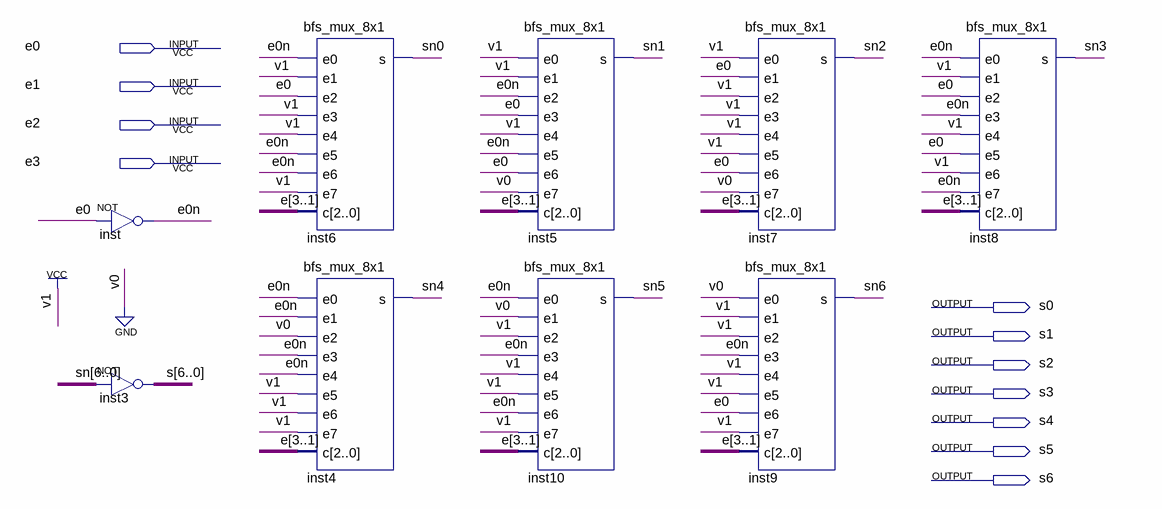
[diagram p0: schematic sheet]
// Quartus schematic bfs_display_7seg.bdf as structural Verilog: 9 symbols, 11 pins
module bfs_display_7seg (
  input  e0,
  input  e1,
  input  e2,
  input  e3,
  output s0,
  output s1,
  output s2,
  output s3,
  output s4,
  output s5,
  output s6
);

  wire e0n;
  wire [6:0] sn;

  not inst (e0n, e0);
  assign {s6, s5, s4, s3, s2, s1, s0} = ~sn;  // NOT inst3, 7 bits wide
  bfs_mux_8x1 inst6 (
    .e0(e0n), .e1(1'b1), .e2(e0), .e3(1'b1), .e4(1'b1), .e5(e0n), .e6(e0n), .e7(1'b1), .c({e3, e2, e1}),
    .s(sn[0]));
  bfs_mux_8x1 inst4 (
    .e0(e0n), .e1(e0n), .e2(1'b0), .e3(e0n), .e4(e0n), .e5(1'b1), .e6(1'b1), .e7(1'b1), .c({e3, e2, e1}),
    .s(sn[4]));
  bfs_mux_8x1 inst5 (
    .e0(1'b1), .e1(1'b1), .e2(e0n), .e3(e0), .e4(1'b1), .e5(e0n), .e6(e0), .e7(1'b0), .c({e3, e2, e1}),
    .s(sn[1]));
  bfs_mux_8x1 inst10 (
    .e0(e0n), .e1(1'b0), .e2(1'b1), .e3(e0n), .e4(1'b1), .e5(1'b1), .e6(e0n), .e7(1'b1), .c({e3, e2, e1}),
    .s(sn[5]));
  bfs_mux_8x1 inst7 (
    .e0(1'b1), .e1(e0), .e2(1'b1), .e3(1'b1), .e4(1'b1), .e5(1'b1), .e6(e0), .e7(1'b0), .c({e3, e2, e1}),
    .s(sn[2]));
  bfs_mux_8x1 inst9 (
    .e0(1'b0), .e1(1'b1), .e2(1'b1), .e3(e0n), .e4(1'b1), .e5(1'b1), .e6(e0), .e7(1'b1), .c({e3, e2, e1}),
    .s(sn[6]));
  bfs_mux_8x1 inst8 (
    .e0(e0n), .e1(1'b1), .e2(e0), .e3(e0n), .e4(1'b1), .e5(e0), .e6(1'b1), .e7(e0n), .c({e3, e2, e1}),
    .s(sn[3]));
endmodule
